# EAGLE design SparkFun NanoBeacon Board - IN100 (EAGLE 9.6.2)
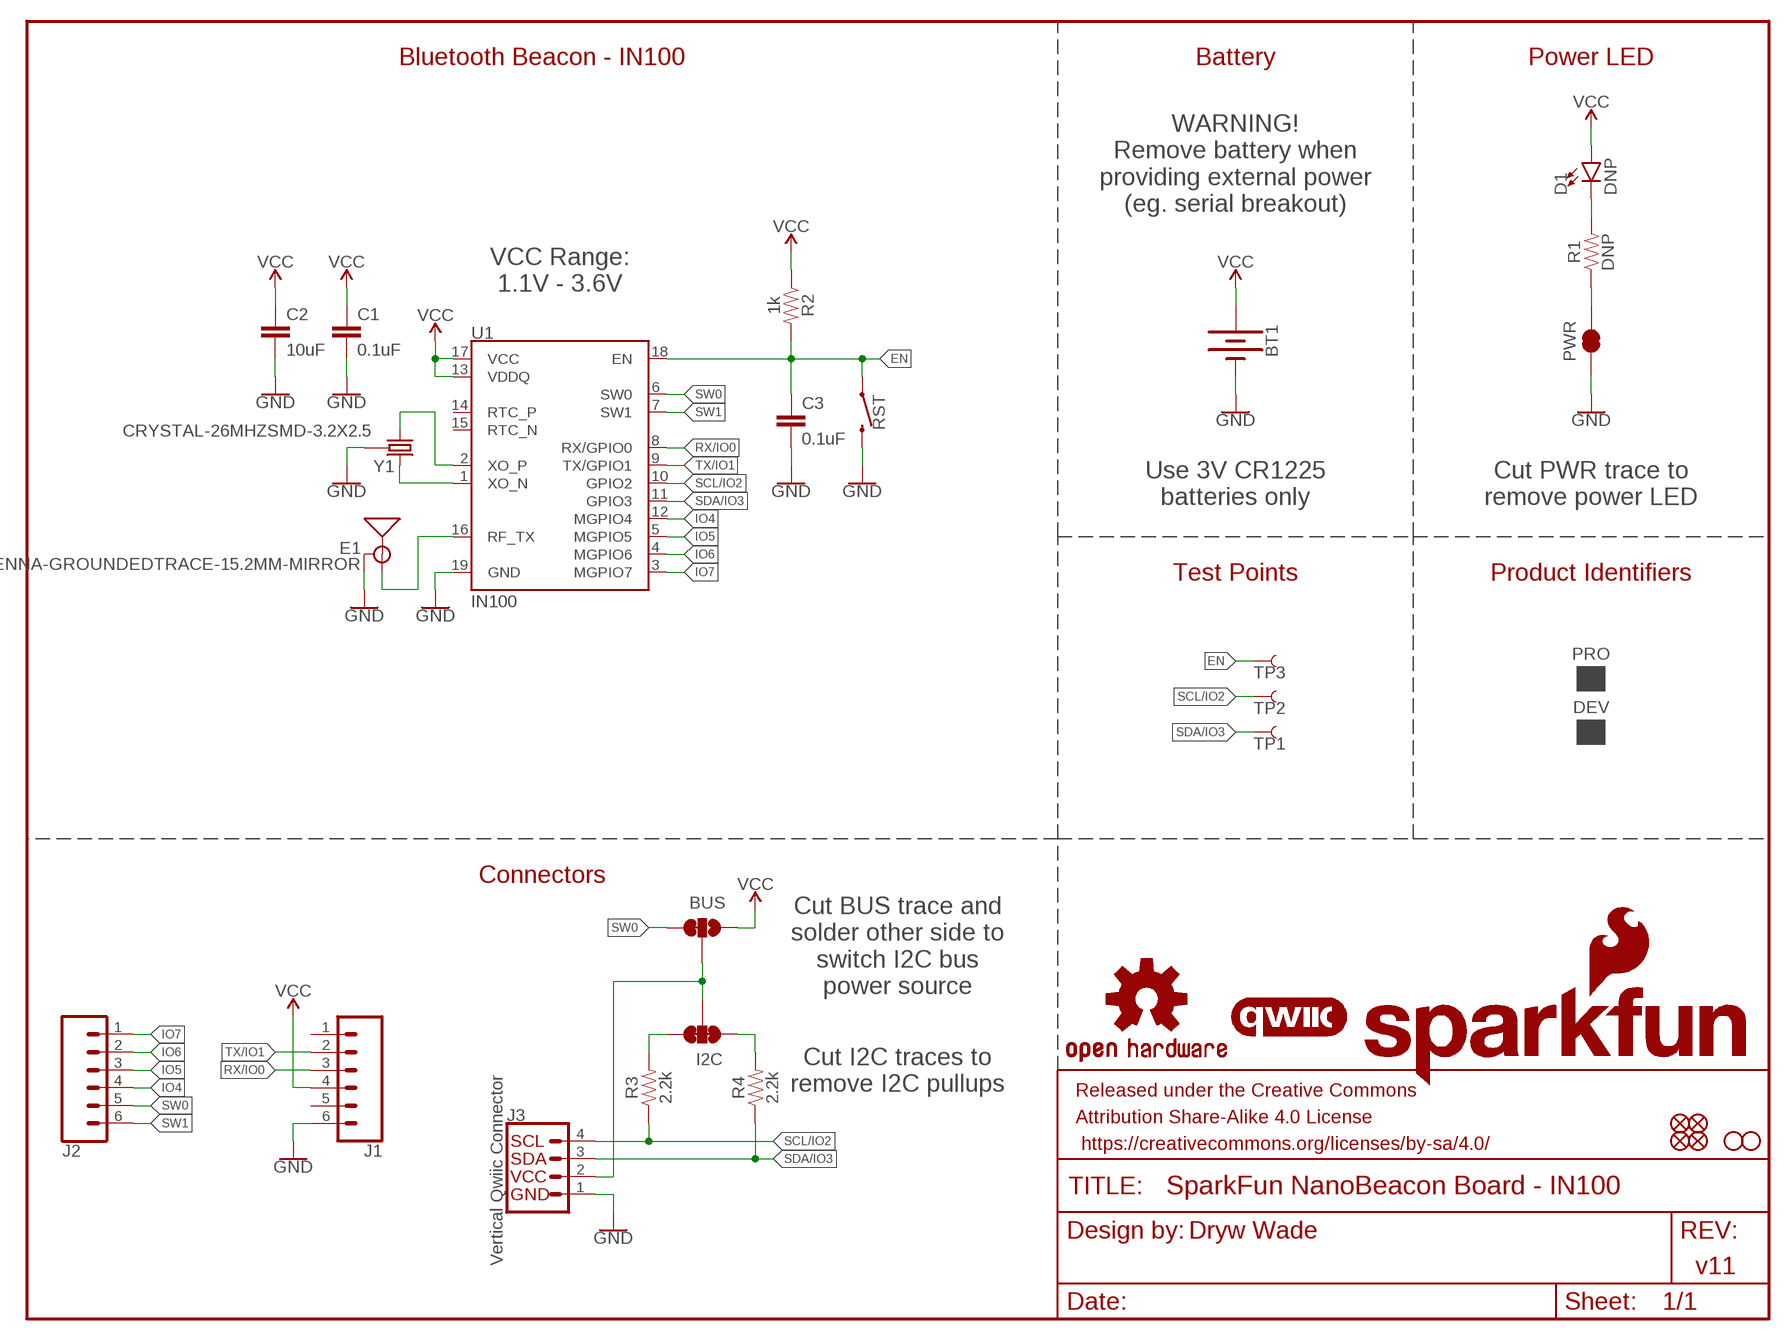
[diagram p0: schematic, sheet 1]

## Parts
BT1  BATTERY-12MM_SMD_BOTH_PWR_PADS  [BATTCON_12MM]
BUS  JUMPER-SMT_3_1-NC_TRACE_SILK  [SMT-JUMPER_3_1-NC_TRACE_SILK]
C1  0.1uF  0.1UF-0402T-6.3V-10%-X7R  [0402-TIGHT]
C2  10uF  10UF-0402T-6.3V-20%  [0402-TIGHT]
C3  0.1uF  0.1UF-0402T-6.3V-10%-X7R  [0402-TIGHT]
D1  DNP  LED-RED_0402  [LED-0402]
DEV  PROD_ID_PASTE_SILK  [PRODUCT_IDENT_PASTE_SILK]
E1  ANTENNA-GROUNDEDTRACE-15.2MM-MIRROR  [TRACE_ANTENNA_2.4GHZ_15.2MM_MIRROR]
FD1  FIDUCIAL1X2  [FIDUCIAL-1X2]
FD2  FIDUCIAL1X2  [FIDUCIAL-1X2]
FD3  FIDUCIAL1X2  [FIDUCIAL-1X2]
FD4  FIDUCIAL1X2  [FIDUCIAL-1X2]
FRAME1  FRAME-LETTER  [CREATIVE_COMMONS]
H1  STAND-OFF  [STAND-OFF]
H2  STAND-OFF  [STAND-OFF]
I2C  JUMPER-SMT_3_2-NC_TRACE_SILK  [SMT-JUMPER_3_2-NC_TRACE_SILK]
J1  CONN_06NO_SILK_NO_POP  [1X06_NO_SILK]
J2  CONN_06NO_SILK_NO_POP  [1X06_NO_SILK]
J3  Vertical Qwiic Connector  QWIIC_CONNECTOR  [JST04_1MM_VERT]
LOGO1  OSHW-LOGOS  [OSHW-LOGO-S]
LOGO2  SFE_LOGO_NAME_FLAME.1_INCH  [SFE_LOGO_NAME_FLAME_.1]
LOGO3  QWIIC_LOGO_5MM  [QWIIC_5MM]
PRO  PROD_ID_PASTE_SILK  [PRODUCT_IDENT_PASTE_SILK]
PWR  JUMPER-SMT_2_NC_TRACE_SILK  [SMT-JUMPER_2_NC_TRACE_SILK]
R1  DNP  2.2KOHM-0402T-1/16W-1%  [0402-TIGHT]
R2  1k  1KOHM-0402T-1/16W-1%  [0402-TIGHT]
R3  2.2k  2.2KOHM-0402T-1/16W-1%  [0402-TIGHT]
R4  2.2k  2.2KOHM-0402T-1/16W-1%  [0402-TIGHT]
RST  DNP  MOMENTARY-SWITCH-SPST-SMD-4.6X2.8MM  [TACTILE_SWITCH_SMD_4.6X2.8MM]
TP1  TEST-POINT3  [PAD.03X.03]
TP2  TEST-POINT3  [PAD.03X.03]
TP3  TEST-POINT3  [PAD.03X.03]
U1  IN100  [IN100]
Y1  CRYSTAL-26MHZSMD-3.2X2.5  [CRYSTAL-SMD-3.2X2.5MM]

## Nets
EN: C3.1 R2.2 RST.1 RST.2 TP3.1 U1.18(EN)
GND: BT1.GND(-) C1.2 C2.2 C3.2 E1.GND J1.6 J3.1 PWR.1 RST.3 RST.4 U1.19(GND) Y1.2(GND) Y1.4(GND)
IO4: J2.4 U1.12(MGPIO4)
IO5: J2.3 U1.5(MGPIO5)
IO6: J2.2 U1.4(MGPIO6)
IO7: J2.1 U1.3(MGPIO7)
N$1: U1.1(XO_N) Y1.3
N$2: U1.2(XO_P) Y1.1
N$3: PWR.2 R1.1
N$4: E1.ANT(SIGNAL) U1.16(RF_TX)
N$5: D1.C R1.2
N$7: I2C.1 R4.2
N$8: BUS.2 I2C.2 J3.2
N$9: I2C.3 R3.2
RX/IO0: J1.3 U1.8(RX/GPIO0)
SCL/IO2: J3.4 R3.1 TP2.1 U1.10(GPIO2)
SDA/IO3: J3.3 R4.1 TP1.1 U1.11(GPIO3)
SW0: BUS.3 J2.5 U1.6(SW0)
SW1: J2.6 U1.7(SW1)
TX/IO1: J1.2 U1.9(TX/GPIO1)
VCC: BT1.PWR@1(+) BT1.PWR@2(+) BUS.1 C1.1 C2.1 D1.A J1.4 R2.1 U1.13(VDDQ) U1.17(VCC)
Unconnected: J1.1 J1.5 U1.14(RTC_P) U1.15(RTC_N)

## Notes on the sheet
- Bluetooth Beacon - IN100 | Battery | Power LED
- WARNING\!
  Remove battery when
  providing external power
  (eg. serial breakout)
- VCC Range:
  1.1V - 3.6V
- Use 3V CR1225
  batteries only
- Cut PWR trace to
  remove power LED
- Test Points | Product Identifiers
- Connectors
- Cut BUS trace and
  solder other side to
  switch I2C bus
  power source
- Cut I2C traces to
  remove I2C pullups
- Dryw Wade
- v11

## Library data of the parts
BT1 = SparkFun-Batteries:BATTERY: Battery - Single Cell A variety of battery chemistries, sizes, and footprints. Device List: 20MM_PTH - Coin Cell Battery Holder - 20mm (PTH) <https://www.sparkfun.com/products/783> 20MM_PTH_KIT- Coin Cell battery Holder - 20 mm (PTH) <http://www.sparkfun.com/products/783>kit version with special mask 6.8MM_PTH - Coin Cell Battery Holder - 6.8MM(SMD) <https://www.digikey.com/product-detail/en/seiko-instruments/MS621FE-FL11E/728-1057-ND/1889208?WT.srch=1&gclid=CNOQ5a6LzdQCFZS2wAodXCkE0g> 12MM_SMD - Coin Cell Battery Holder - 12mm (SMD) <https://www.sparkfun.com/products/10592> 12MM_PTH - Coin Cell Battery Holder - 12mm (PTH) <https://www.sparkfun.com/products/7948> 20MM_SMD - 20mm Coin Cell Battery Holder (SMD) (2 legs) Used on the Big Time Watch Kit <https://www.sparkfun.com/products/11734> 20MM_SMD_4LEGS - Coin Cell Battery Holder - 20mm (SMD) <https://www.sparkfun.com/products/11892> 20MM_SMD_4LEGS_OVERPASTE - Coin Cell Battery Holder - 20mm (SMD) <https://www.sparkfun.com/products/11892> (Over-paste on the legs) 24.5MM_PTH - Coin Cell Battery Holder - 24.5mm (PTH) <https://www.sparkfun.com/products/8863> 9V - 9V Battery Holder - PC Mount Used on the SparkFun SparkPunk Sound Kit <https://www.sparkfun.com/products/11177> and SparkFun SparkPunk Sequencer Kit <https://www.sparkfun.com/products/12707> 18650 - Battery Holder - 18650 (PTH) <https://www.sparkfun.com/products/13113> AA - Battery Holder - 1xAA (PTH) <https://www.sparkfun.com/products/7949> AAA - Battery Holder - 1xAAA (PTH) <https://www.sparkfun.com/products/12718> AA_KIT - Battery Holder - 1xAA (PTH) <https://www.sparkfun.com/products/7949> Special kit package - pads only have exposed copper on one side of the board. AAA_KIT - Battery Holder - 1xAAA (PTH) <https://www.sparkfun.com/products/12718> Special kit package - pads only have exposed copper on one side of the board.
BUS = SparkFun-Jumpers:JUMPER-SMT_3_1-NC_TRACE: Normally closed trace jumper (1 of 2 connections) This jumper has a trace between two pads so it's normally closed (NC). The other connection is normally open (NO). Use a razor knife to open the connection. For best results follow the IPC guidelines for cutting traces: Cutout at least 0.063 mm (0.005 in). Remove all loose material to clean up the cut area. Seal the cut with an approved epoxy. Reapply solder to reclose the connection, or to close the NO connection.
C1 C3 = SparkFun-Capacitors:0.1UF: 0.1µF ceramic capacitors A capacitor is a passive two-terminal electrical component used to store electrical energy temporarily in an electric field.; PROD_ID: CAP-14993
C2 = SparkFun-Capacitors:10UF: 10.0µF ceramic capacitors A capacitor is a passive two-terminal electrical component used to store electrical energy temporarily in an electric field.; PROD_ID: CAP-14848
D1 = SparkFun-LED:LED-RED: Red SMD LED Used in manufacturing of most products at SparkFun Packages: 0603 - SMD 0603 package [Product Link] <http://docs.avagotech.com/docs/AV02-0551EN> 0603 SMART - SMD 0603 SMART package ( more efficient and expensive)[Product Link] <http://www.osram-os.com/Graphics/XPic2/00077099_0.pdf> 1206 - SMD1206 package [Product Link] <https://www.sparkfun.com/datasheets/DevTools/LilyPad/Q150OVS4.pdff> SparkFun Products: Pro Mini 328 -5V <https://www.sparkfun.com/products/821> RedBoard <https://www.sparkfun.com/products/12757> IOIO-OTG <https://www.sparkfun.com/products/13613>; VALUE: RED
DEV PRO = SparkFun-Aesthetics:PROD_ID_PASTE
E1 = SparkFun-RF:ANTENNA-GROUNDED: Antenna w/ Ground Connection 2.4GHz antennae with signal and ground terminals. TRACE_ANTENNA_2.4GHZ_15.2MM - Meander Trace antenna 15.2 x 5.7mm footprint Based on layout from TI app note AN043 <http://www.ti.com/lit/an/swra117d/swra117d.pdf>. TRACE_ANTENNA_2.4GHZ_25.7MM - Inverted F trace antenna 25.7 x 7.5 mm footprint. Based on layout from TI design note DN0007 <http://www.ti.com/lit/an/swru120b/swru120b.pdf>.
FD1-FD4 = SparkFun-Aesthetics:FIDUCIAL: Fiducial Alignment Points Point-of-reference for pick-and-place machines and other optical instruments.
FRAME1 = SparkFun-Aesthetics:FRAME-LETTER: Schematic Frame - Letter Standard 8.5x11 US Letter frame
H1 H2 = SparkFun-Hardware:STAND-OFF: Stand Off Drill holes for mechanically mounting via screws, standoffs, etc. Note: Use the keepout ring to avoid running the screw head into surrounding components. Variant Overviews STAND-OFF - Mechanical footprint for a #4 phillips button head screw. STAND-OFF-TIGHT - Mechanical footprint for a #4 phillips button head screw, Example SparkFun Products Screw - Phillips Head (1/4", 4-40, 10 pack) <https://www.sparkfun.com/products/10453> (PRT-10453) Screw - Phillips Head (1/2", 4-40, 10 pack) <https://www.sparkfun.com/products/10452> (PRT-10452) Screw - Phillips Head (3/4", 4-40, 10 pack) <https://www.sparkfun.com/products/10451> (PRT-10451) Screw - Phillips Head (1", 4-40, 10 pack) <https://www.sparkfun.com/products/10450> (PRT-10450)
I2C = SparkFun-Jumpers:JUMPER-SMT_3_2-NC_TRACE: Normally closed trace jumper (2 of 2 connections) This jumper has a trace between all three pads so they are normally closed (NC). Use a razor knife to open the connection(s). For best results follow the IPC guidelines for cutting traces: Cutout at least 0.063 mm (0.005 in). Remove all loose material to clean up the cut area. Seal the cut with an approved epoxy. Reapply solder to reclose the connection(s).
J1 J2 = SparkFun-Connectors:CONN_06: Multi connection point. Often used as Generic Header-pin footprint for 0.1 inch spaced/style header connections On any of the 0.1 inch spaced packages, you can populate with these: Break Away Headers - Straight <https://www.sparkfun.com/products/116> (PRT-00116) Break Away Male Headers - Right Angle <https://www.sparkfun.com/products/553> (PRT-00553) Female Headers <https://www.sparkfun.com/products/115> (PRT-00115) Break Away Headers - Machine Pin <https://www.sparkfun.com/products/117> (PRT-00117) Break Away Female Headers - Swiss Machine Pin <https://www.sparkfun.com/products/743> (PRT-00743) Arduino Stackable Header - 6 Pin <https://www.sparkfun.com/products/9280> (PRT-09280) Screw Terminals 2.54mm Pitch (6-Pin) <https://www.sparkfun.com/products/16499> (PRT-16499) For SCREWTERMINALS and SPRING TERMINALS visit here: Screw Terimnals on SparkFun.com <https://www.sparkfun.com/search/results?term=Screw+Terminals> (5mm/3.5mm/2.54mm spacing) This device is also useful as a general connection point to wire up your design to another part of your project. Our various solder wires solder well into these plated through hole pads. Hook-Up Wire - Assortment (Stranded, 22 AWG) <https://www.sparkfun.com/products/11375> (PRT-11375) Hook-Up Wire - Assortment (Solid Core, 22 AWG) <https://www.sparkfun.com/products/11367> (PRT-11367) View the entire wire category on our website here <https://www.sparkfun.com/categories/141>
J3 = SparkFun-Connectors:QWIIC_CONNECTOR: SparkFun I2C Standard Qwiic Connector An SMD 1mm pitch JST connector makes it easy and quick (get it? Qwiic?) to connect I2C devices to each other. The Qwiic system <http://www.sparkfun.com/qwiic> enables fast and solderless connection between popular platforms and various sensors and actuators. We carry 200mm <https://www.sparkfun.com/products/14204>, 100mm <https://www.sparkfun.com/products/14205>, 50mm <https://www.sparkfun.com/products/14206>, and breadboard friendly <https://www.sparkfun.com/products/14207> Qwiic cables. We also offer 10 pcs strips <https://www.sparkfun.com/products/14323> the SMD connectors.; PROD_ID: CONN-14483
LOGO1 = SparkFun-Aesthetics:OSHW-LOGO: Open-Source Hardware (OSHW) Logo This logo indicates the piece of hardware it is found on incorporates a OSHW license and/or adheres to the definition of open source hardware found here: http://freedomdefined.org/OSHW
LOGO2 = SparkFun-Aesthetics:SFE_LOGO_NAME_FLAME: SparkFun Font Logo w/ Flame This is the SparkFun full logo. The logo on the schematic will always be the same size; the package variant is the height of the flame part of the logo. Default layer for the logo on the board is tSilk.
LOGO3 = SparkFun-Aesthetics:QWIIC_LOGO: Qwiic Logos for placement on schematic and PCB. The 5.5mm silk logo is best for placing next to Qwiic connector.
PWR = SparkFun-Jumpers:JUMPER-SMT_2_NC_TRACE: Normally closed trace jumper This jumper has a trace between two pads so it's normally closed (NC). Use a razor knife to open the connection. For best results follow the IPC guidelines for cutting traces: Cutout at least 0.063 mm (0.005 in). Remove all loose material to clean up the cut area. Seal the cut with an approved epoxy. Reapply solder to reclose the connection.
R1 = SparkFun-Resistors:2.2KOHM: 2.2kΩ resistor A resistor is a passive two-terminal electrical component that implements electrical resistance as a circuit element. Resistors act to reduce current flow, and, at the same time, act to lower voltage levels within circuits. - Wikipedia; VALUE: 2.2k
R2 = SparkFun-Resistors:1KOHM: 1kΩ resistor A resistor is a passive two-terminal electrical component that implements electrical resistance as a circuit element. Resistors act to reduce current flow, and, at the same time, act to lower voltage levels within circuits. - Wikipedia; PROD_ID: RES-14342
R3 R4 = SparkFun-Resistors:2.2KOHM: 2.2kΩ resistor A resistor is a passive two-terminal electrical component that implements electrical resistance as a circuit element. Resistors act to reduce current flow, and, at the same time, act to lower voltage levels within circuits. - Wikipedia; PROD_ID: RES-14341
RST = SparkFun-Switches:MOMENTARY-SWITCH-SPST: Momentary Switch (Pushbutton) - SPST Normally-open (NO) SPST momentary switches (buttons, pushbuttons). Variants PTH-12MM - 12mm square, through-hole Momentary Pushbutton Switch - 12mm Square <https://www.sparkfun.com/products/9190> (COM-09190) PTH-6.0MM, PTH-6.0MM-KIT - 6.0mm square, through-hole Mini Pushbutton Switch <https://www.sparkfun.com/products/97> (COM-00097) KIT package intended for soldering kit's - only one side of pads' copper is exposed. PTH-RIGHT-ANGLE-KIT - Right-angle, through-hole Right Angle Tactile Button <https://www.sparkfun.com/products/10791> - Used on SparkFun BigTime Watch Kit <https://www.sparkfun.com/products/11734> SMD-12MM - 12mm square, surface-mount Tactile Button - SMD (12mm) <https://www.sparkfun.com/products/12993> (COM-12993) Used on SparkFun PicoBoard <https://www.sparkfun.com/products/11888> SMD-4.5MM - 4.5mm Square Trackball Switch Used on SparkFun Blackberry Trackballer Breakout <https://www.sparkfun.com/products/13169> SMD-4.6MMX2.8MM - 4.60mm x 2.80mm, surface mount Used on SparkFun Pro Micro - RP2040 <https://www.sparkfun.com/products/17717> SMD-5.2MM, SMD-5.2-REDUNDANT - 5.2mm square, surface-mount Mini Pushbutton Switch - SMD <https://www.sparkfun.com/products/8720> (COM-08720) Used on Arduino Pro Mini <https://www.sparkfun.com/products/11114> REDUNDANT package connects both switch circuits together SMD-6.0X3.5MM - 6.0 x 3.5mm, surface mount Momentary Reset Switch SMD <https://www.sparkfun.com/products/8229> (COM-08229) SMD-6.2MM-TALL - 6.2mm square, surface mount Tactile Button - SMD (6mm) <https://www.sparkfun.com/products/12992> Used on SparkFun Digital Sandbox <https://www.sparkfun.com/products/12651> SMD-RIGHT-ANGLE - Right-angle, surface mount Used on SparkFun Block for Intel® Edison - Arduino <https://www.sparkfun.com/products/13036>
TP1-TP3 = SparkFun-Connectors:TEST-POINT: SparkFun Test Points Bare copper test points for troubleshooting or In-Circuit-Testing. These are used by our Production team for verifying production board runs using pogo-pins on test beds. SparkFun Products: SparkFun LSM9DS1 Breakout <https://www.sparkfun.com/products/13284> SparkFun PSOC <https://www.sparkfun.com/products/13714> SparkFun Load Cell Amplifier <https://www.sparkfun.com/products/13879>
U1 = SparkFun-RF:IN100; PROD_ID: IC-17260
Y1 = SparkFun-Clocks:CRYSTAL-26MHZ: 26MHz Crystal w/ Ground Pin Digikey Example <http://www.digikey.com/product-detail/en/epson/TSX-3225%2026.0000MF09Z-AC3/SER3627CT-ND/1802878> Frequency: 26MHz Frequency Stability: ±9ppm Frequency Tolerance: ±10ppm Load Capacitance: 9pF SparkFun Products: SparkFun ESP32 Thing <https://www.sparkfun.com/products/13907> SparkFun ESP8266 Thing Dev Board <https://www.sparkfun.com/products/13711>; PROD_ID: XTAL-12454

## Board
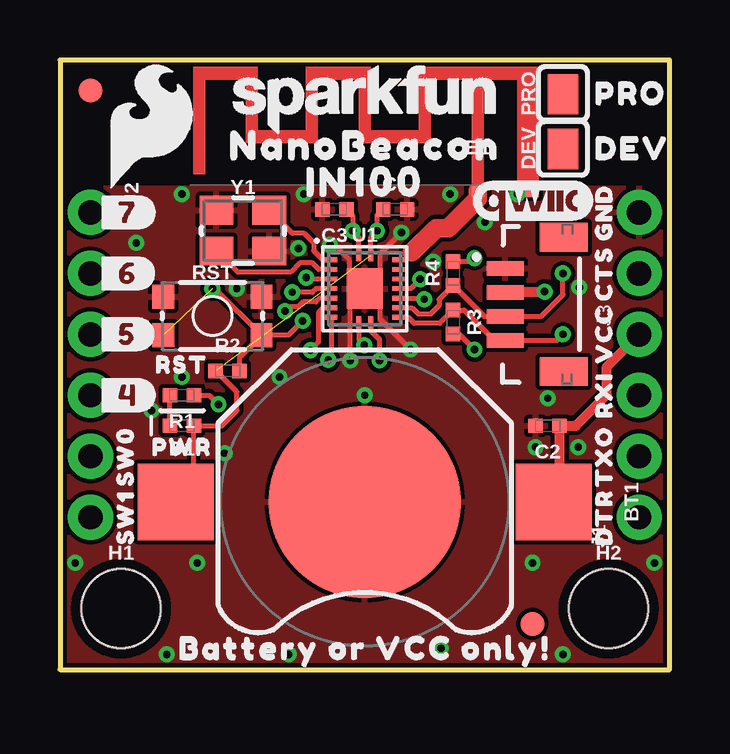
[diagram p1: board, top side]
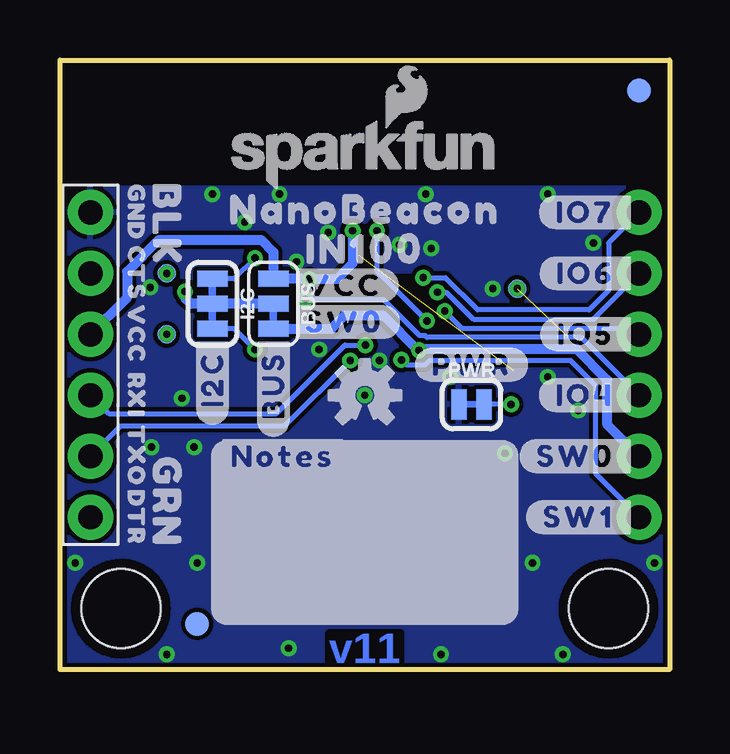
[diagram p2: board, bottom side, seen from below]

Size 25.4 x 25.4 mm. Coordinates in mm from the lower left corner, seen from the top.
Outline: 0,0 25.4,0 25.4,25.4 0,25.4 0,0
Copper layers (1*16): Top 0.035mm / dielectric 1.5mm / Bottom 0.035mm
Design rules "SparkFun-2-Layer-General-JLCPCB *": minimum track width 7mil, minimum drill 0.3mm, track to track 7mil, track to pad 7mil, pad to pad 7mil, via to via 7mil, smd to smd 7mil, copper to edge 7mil, drill to drill 7mil, minimum pad ring 7mil, minimum via ring 7mil, stop-mask expansion 3mil, vias tented up to drill 25mil, thermal gap 7mil
tRestrict: area 11.7,16.8 to 11.8,16.9; area 13.6,16.8 to 13.7,16.9; area 11.7,14.9 to 11.8,15; area 13.6,14.9 to 13.7,15
bRestrict: area 10.8,16.3 to 11.6,16.4

### Footprints (pad centres in the part's own frame; a part is rotated, then mirrored left to right if it is on the bottom)
BATTCON_12MM = smd 8 x 8: GND 0,0 | smd 3.175 x 3.175: PWR@1 -7.874,0; PWR@2 7.874,0
SMT-JUMPER_3_1-NC_TRACE_SILK = smd 0.66 x 1.27: 1 -1.041,0; 2 0,0; 3 1.041,0
0402-TIGHT = smd 0.6 x 0.6: 1 -0.5,0; 2 0.5,0
LED-0402 = smd 0.6 x 0.6: A -0.5,0; C 0.5,0
PRODUCT_IDENT_PASTE_SILK = smd 1.676 x 1.27: 1 -0.025,0
TRACE_ANTENNA_2.4GHZ_15.2MM_MIRROR = smd 0.5 x 0.5: ANT 0,-0.25 | smd 0.9 x 0.5: GND 2.1,-0.25
FIDUCIAL-1X2 = smd 1 x 1: 1 0,0
STAND-OFF = hole 3.302: 0,0
SMT-JUMPER_3_2-NC_TRACE_SILK = smd 0.66 x 1.27: 1 -1.041,0; 2 0,0; 3 1.041,0
1X06_NO_SILK = drill 1.016 pad 1.88: 1 0,0; 2 2.54,0; 3 5.08,0; 4 7.62,0; 5 10.16,0; 6 12.7,0
JST04_1MM_VERT = smd 0.6 x 1.55: 1 -1.478,0.775; 2 -0.478,0.775; 3 0.522,0.775; 4 1.522,0.775 | smd 1.2 x 2: NC1 -2.778,3.2; NC2 2.822,3.2
SMT-JUMPER_2_NC_TRACE_SILK = smd 0.66 x 1.27: 1 -0.521,0; 2 0.521,0
TACTILE_SWITCH_SMD_4.6X2.8MM = smd 0.9 x 1: 1 -2.05,-0.8; 2 2.05,-0.8; 3 2.05,0.8; 4 -2.05,0.8
PAD.03X.03 = smd 0.762 x 0.762: 1 0,0
IN100 = smd 0.5 x 0.2: 1 -1.4,1.2; 2 -1.4,0.8; 3 -1.4,0.4; 4 -1.4,0; 5 -1.4,-0.4; 6 -1.4,-0.8; 7 -1.4,-1.2; 10 1.4,-1.2; 11 1.4,-0.8; 12 1.4,-0.4; 13 1.4,0; 14 1.4,0.4; 15 1.4,0.8; 16 1.4,1.2 | smd 0.2 x 0.5: 8 -0.25,-1.4; 9 0.25,-1.4; 17 0.25,1.4; 18 -0.25,1.4 | smd 1.5 x 1.7: 19 0,0
CRYSTAL-SMD-3.2X2.5MM = smd 1.4 x 1.2: 1 -1.1,-0.85; 2 1.1,-0.85; 3 1.1,0.85; 4 -1.1,0.85

### Placement (x,y rotation side)
BT1  12.7,6.99 180 top
BUS  16.51,15.24 270 bottom
C1  13.97,19.18 0 top
C2  20.32,10.16 180 top
C3  11.43,19.18 180 top
D1  5.08,10.16 180 top
DEV  20.95,21.72 90 top
E1  17.4,20.19 0 top
FD1  1.27,24.13 0 bottom
FD2  1.27,24.13 0 top
FD3  19.68,1.91 0 bottom
FD4  19.68,1.91 0 top
FRAME1  -10.16,-25.4 0 top  (outside the outline)
H1  2.54,2.54 0 top
H2  22.86,2.54 0 top
I2C  19.05,15.24 270 bottom
J1  24.13,6.35 90 top
J2  1.27,19.05 270 top
J3  17.78,15.24 270 top
LOGO1  12.7,11.43 0 bottom
LOGO2  12.7,21.46 0 bottom
LOGO3  19.68,19.56 0 top
PRO  20.95,24 90 top
PWR  8.26,11.05 0 bottom
R1  5.08,11.43 180 top
R2  6.99,12.45 0 top
R3  16.38,14.48 270 top
R4  16.38,16.51 90 top
RST  6.35,14.73 0 top
TP1  20.95,16.51 0 bottom
TP2  20.95,13.97 0 bottom
TP3  6.35,15.88 0 bottom
U1  12.7,15.88 0 top
U$1  [NANOBEACON0]  12.7,19.18 0 bottom
U$2  [#_7#0]  1.4,19.05 0 top
U$3  [#_6#0]  1.4,16.51 0 top
U$4  [SFE_LOGO_NAME_.1]  12.7,23.75 0 top
U$5  [IN1000]  12.7,17.53 0 bottom
U$6  [#_5#0]  1.4,13.97 0 top
U$7  [#_4#0]  1.4,11.43 0 top
U$8  [SFE_LOGO_FLAME_.2]  3.81,22.61 0 top
U$9  [BATTERY_OR_VCC_ONLY##0]  12.7,0.89 0 top
U$11  [#I2C#0]  19.05,13.97 90 bottom
U$12  [#NOTES#0]  16.13,8.89 0 bottom
U$13  [#IO7_#0]  1.27,19.05 0 bottom
U$14  [#IO6_#0]  1.27,16.51 0 bottom
U$15  [#IO5_#0]  1.27,13.97 0 bottom
U$16  [#IO4_#0]  1.27,11.43 0 bottom
U$17  [#SW0_#0]  1.27,8.89 0 bottom
U$18  [#SW1_#0]  1.27,6.35 0 bottom
U$19  [#PWR#0]  8.26,12.7 0 bottom
U$20  [#SW0#3]  15.88,14.48 0 bottom
U$21  [SW00]  2.73,8.89 90 top
U$22  [SW10]  2.73,6.35 90 top
U$23  [RST0]  5.08,12.7 0 top
U$24  [#VCC#0]  15.88,16 0 bottom
U$25  [#BUS#0]  16.51,13.97 90 bottom
U$26  [PWR0]  5.08,9.27 0 top
U$28  [DEV0]  21.59,21.72 0 top
U$29  [NANOBEACON0]  12.7,21.84 0 top
U$30  [PRO0]  21.59,24 0 top
U$31  [IN1000]  12.7,20.32 0 top
Y1  7.62,18.29 0 top

### Tracks (layer width: path | path; a pad name or v marks a point on that pad's centre or on a via)
EN  (via drill 0.3)  (1 unrouted)
  Top 0.203: C3.1 12.19,18.91 v12.19,18.29 12.45,18.03 U1.18 | v10.11,14.53 9.51,13.93 RST.2 | R2.2 7.49,13.02 RST.2 | RST.2 6.46,15.88 TP3.1
  Bottom 0.203: v12.19,18.29 12.19,16.61 v10.11,14.53
  other vias: 6.35,15.88
GND  (via drill 0.3)
  Top 0.203: U1.19 13.34,16.51 13.34,17.32 v14.22,18.21 | U1.19 12.06,16.51 12.06,17.05 11.42,17.7 v11.25,17.7 | U1.19 12.06,15.24 12.06,12.9 v12.09,12.88 | U1.19 13.34,15.24 13.34,14.61 v14.61,13.34
  other vias: 15.54,16.99 16.26,19.81 19.05,19.81 17.7,18.64 10.16,19.81 5.08,19.81 21.64,15.93 6.86,9.02 4.45,0.64 20.95,0.64 15.88,0.89 9.53,0.64 20.32,11.3 12.7,11.43 19.81,9.27 21.59,9.27 19.68,4.45 5.71,4.45 0.64,4.45 24.77,4.45 9.93,17.55 7.37,15.88 5.08,12.19 3.81,10.79 9.14,12.19 3.17,17.78
  pour Top (isolate 0.127): 0,0 25.4,0 25.4,20.07 0,20.07
  pour Bottom (isolate 0.127): 25.4,0 0,0 0,20.07 25.4,20.07
IO4  (via drill 0.3)
  Top 0.203: U1.12 15.13,15.47 v15.18,15.43
  Bottom 0.203: v15.18,15.43 11.93,15.43 10.41,13.92 10.19,13.92 10.11,13.84 3.68,13.84 J2.4
IO5  (via drill 0.3)
  Top 0.203: U1.5 10.82,15.47 10.66,15.32 10.14,15.32 9.93,15.11 9.55,15.11 v9.37,14.94
  Bottom 0.203: v9.37,14.94 8.66,14.22 1.52,14.22 J2.3
IO6  (via drill 0.3)
  Top 0.203: U1.4 10.67,15.88 10.52,15.72 v9.68,15.72
  Bottom 0.203: v9.68,15.72 9.3,15.72 8.18,14.61 3.17,14.61 J2.2
IO7  (via drill 0.3)
  Top 0.203: U1.3 10.32,16.27 v10.26,16.33
  Bottom 0.203: v10.26,16.33 9.35,16.33 8,14.99 3.35,14.99 2.54,15.8 2.54,17.78 J2.1
N$1
  Top 0.203: Y1.3 9.69,18.17 10.17,18.17 10.56,17.78 10.56,17.46 10.94,17.07 U1.1
N$2
  Top 0.203: U1.2 10.78,16.68 10.51,16.94 9.99,16.94 9.61,16.56 7.4,16.56 Y1.1
N$3  (via drill 0.3)
  Top 0.203: R1.1 6.22,11.43 v6.6,11.05
  Bottom 0.203: v6.6,11.05 PWR.2
N$4
  Top 0.203: 14.66,17.38 14.35,17.07 U1.16
  Top 0.762: E1.ANT 17.4,19.61 16.18,18.39 15.68,18.39 14.66,17.38
N$5
  Top 0.203: D1.C R1.2
N$7  (via drill 0.3)
  Top 0.203: R4.2 17.14,17.01 v17.27,17.14
  Bottom 0.203: v17.27,17.14 18.14,16.28 I2C.1
N$8  (via drill 0.3)
  Top 0.406: v20.19,15.75 20.16,15.72 J3.2
  Bottom 0.406: v20.19,15.75 20.19,15.49 19.94,15.24 I2C.2 BUS.2
N$9  (via drill 0.3)
  Top 0.203: R3.2 16.63,13.98 v17.27,13.34
  Bottom 0.203: v17.27,13.34 18.14,14.2 I2C.3
RX/IO0  (via drill 0.3)
  Top 0.203: U1.8 12.45,13.75 v12.68,13.52
  Bottom 0.203: v12.68,13.52 13.53,13.52 16.38,10.67 23.37,10.67 J1.3
SCL/IO2  (via drill 0.3)
  Top 0.203: U1.10 14.51,14.68 14.76,14.42 15.83,14.42 R3.1 16.84,14.98 18.1,13.72 J3.4 20.7,13.72 TP2.1
  other vias: 20.95,13.97
SDA/IO3  (via drill 0.3)
  Top 0.203: U1.11 14.67,15.07 14.92,14.82 15.45,14.82 15.8,15.17 15.8,15.43 R4.1 17.68,14.72 J3.3 20.05,14.72 20.95,15.62 TP1.1
  other vias: 20.95,16.51
SW0  (via drill 0.3)
  Top 0.203: U1.6 10.97,15.07 10.77,14.88 10.77,13.64 v10.44,13.31
  Bottom 0.406: J2.5 2.59,10.21 2.59,12.06 3.89,13.36 10.39,13.36 v10.44,13.31 10.49,13.31 11.94,14.76 13.54,14.76 14.1,14.2 BUS.3
SW1  (via drill 0.3)
  Top 0.203: v11.18,12.9 11.3,13.03 U1.7
  Bottom 0.203: J2.6 3.07,8.15 3.07,11.84 4.12,12.88 10.01,12.88 10.19,12.7 10.97,12.7 v11.18,12.9
TX/IO1  (via drill 0.3)
  Top 0.203: U1.9 12.95,14.13 13.31,13.77 v13.31,12.88
  Bottom 0.203: J1.2 22.86,10.16 16.03,10.16 v13.31,12.88
VCC  (via drill 0.3)  (1 unrouted)
  Top 0.203: v15.01,16.27 14.61,15.88 U1.13 | C1.1 13.21,18.91 v13.21,18.29 12.95,18.03 U1.17 | BT1.PWR@2 5.58,7.74 D1.A 6.73,10.16 7.37,10.79 7.37,11.57 R2.1
  Top 0.406: BT1.PWR@1 20.82,7.23 C2.1 21.5,10.16 22.78,11.45 22.78,12.62 J1.4
  Bottom 0.406: J1.4 22.61,15.49 22.61,16.59 21.29,17.91 17.02,17.91 16.51,17.4 BUS.1 v15.02,16.28 v15.01,16.27 13.86,16.27 13.21,16.93 v13.21,18.29

### Text on the board
Bottom: v11
Measures: Units: inches
tDocu: Dryw Wade